# Altium project Standalone Battery Charger.PrjPcb (part 2 of 2)
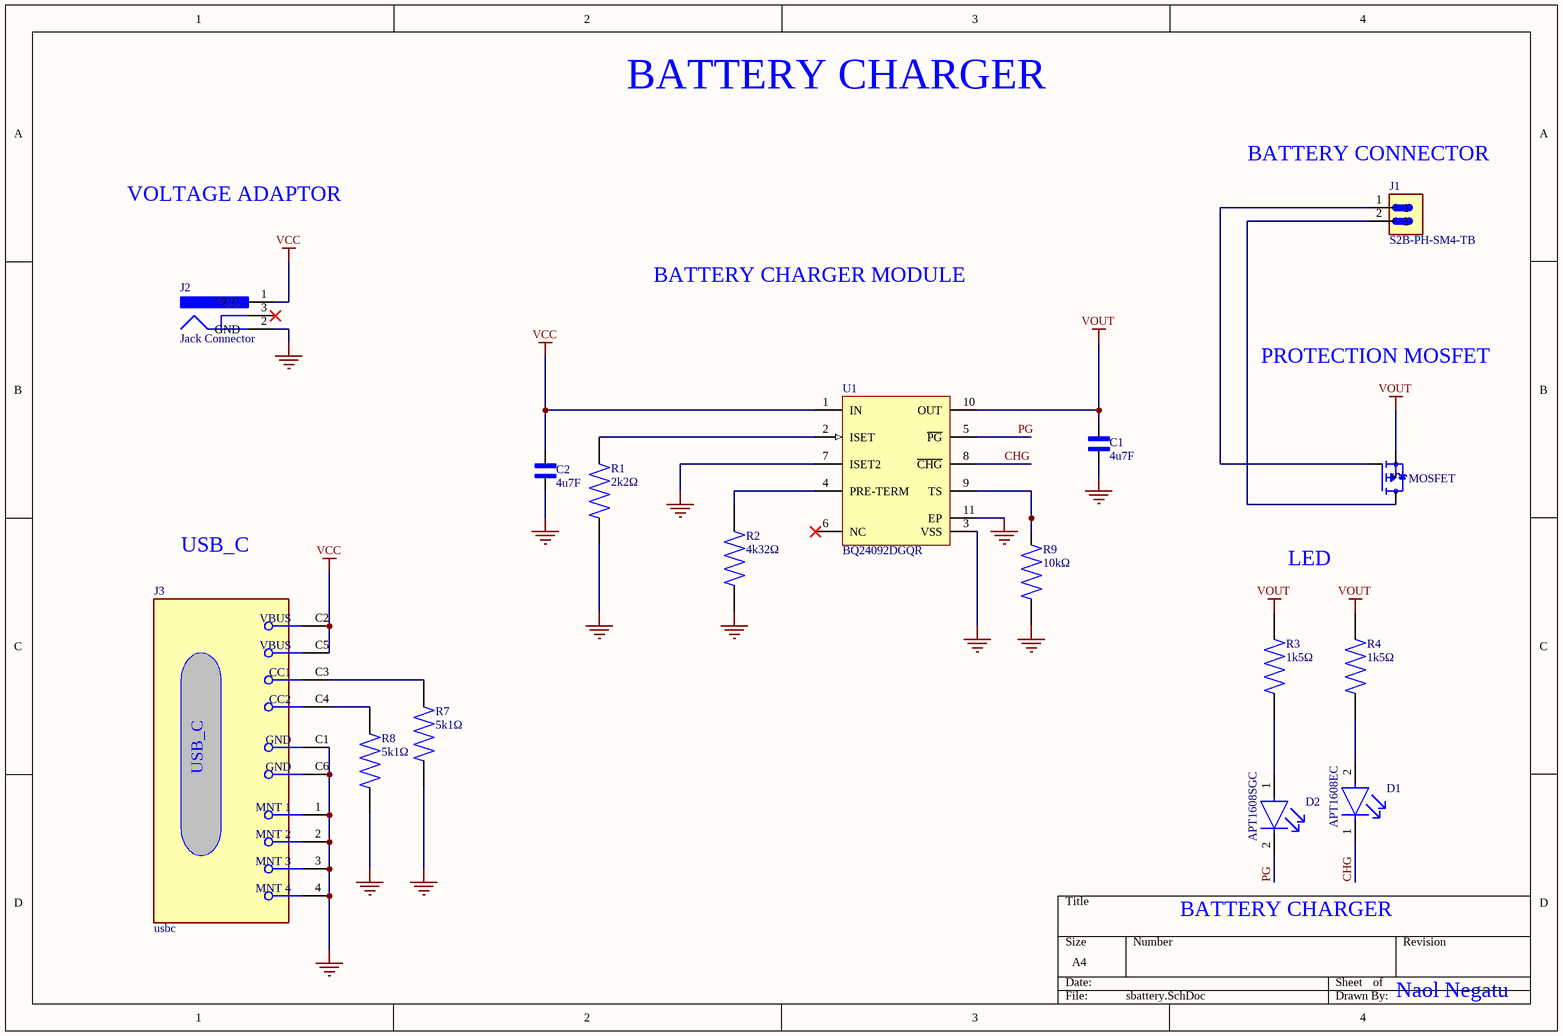
[diagram p1: sbattery.SchDoc]

## Sheet sbattery.SchDoc (continued)

### Library data of the parts (continued)
U1 = BQ24092DGQR: 1-cell, 1-A, Li-ion battery charger with operation over JEITA and 10kΩ NTC 10-HVSSOP -40 to 150; Manufacturer: Texas Instruments; Manufacturer Lifecycle Status: ACTIVE; Battery Pack Voltage: 4.2V; Fault Protection: Over Temperature, Over Voltage, Short Circuit; Interface: USB; Max Charge Current: 1A; Max Supply Voltage: 6.45V; Min Input Voltage: 4.5V; Min Supply Voltage: 3.5V; Number of Cells: 1; Supplier: DigiKey; Supplier Part Number: 296-41204-2-ND; Manufacturer Part Number: BQ24092DGQR; RoHS: Compliant; Category: Battery Management; Stock: 8548; Pricing: 2500=0.68891, 5000=0.67306, 7500=0.66512, 12500=0.65632 (USD); Case/Package: HTSSOP EP; Contact Plating: Gold; Height: 1.1mm; Lead Free: Lead Free; Length: 3mm; Lifecycle Status: Production; Max Operating Temperature: 125°C; Min Operating Temperature: -40°C; Pins: 10; Output Current: 1A; Output Voltage: 4.2V; Packaging: Tape & Reel (TR); Radiation Hardening: No; Schedule B: 8542390000, 8542390000|8542390000|8542390000|8542390000|8542390000; Thickness: 1.02mm; Width: 3mm; ComponentLink1URL: https://sigma.octopart.com:443/151908762/technical_drawing/Texas-Instruments-BQ24092DGQR.pdf?src-supplier=Texas+Instruments; ComponentLink1Description: https://sigma.octopart.com:443/151908762/technical_drawing/Texas-Instruments-BQ24092DGQR.pdf?src-supplier=Texas+Instruments; ComponentLink2URL: https://octopart.com:443/opatz8j6/c1?t=I4L_5yvCBpDFmJzBUD7xXRTyJHZFz8Vie7DDMexhgd_R5CVS8O1brsykVWSszK7PlQIjFRdFbRxs_cy10GZkWLPuEzsvgZTYF2NXEUHmN4sAQxE8bVBEcZC275qzirla-L-oJNJhEX5LmJmM2EXwk3EFsfYROaw8LmrFg9NhT1mx60rvpKNI9a36HI6ThgYwGQRStl18BqKQUrAbhSp5Wi_HxJff8WELpdCqiygBHP7SLygD4TmEifhtn01ouQFK53G1NLqB-fa8Ml_ZKfK0nFnib--2iALwfa4BBLIbsOyNQrybwu1ndBra9hRkefzWYbL7eDaQQPNTeA4Bly6oxRyA0mVZNRxcs2KHaGZXt2978JGPJtvfLop7MU-7fw_S1MKPRM0&src-supplier=Texas+Instruments; ComponentLink2Description: https://octopart.com:443/opatz8j6/c1?t=I4L_5yvCBpDFmJzBUD7xXRTyJHZFz8Vie7DDMexhgd_R5CVS8O1brsykVWSszK7PlQIjFRdFbRxs_cy10GZkWLPuEzsvgZTYF2NXEUHmN4sAQxE8bVBEcZC275qzirla-L-oJNJhEX5LmJmM2EXwk3EFsfYROaw8LmrFg9NhT1mx60rvpKNI9a36HI6ThgYwGQRStl18BqKQUrAbhSp5Wi_HxJff8WELpdCqiygBHP7SLygD4TmEifhtn01ouQFK53G1NLqB-fa8Ml_ZKfK0nFnib--2iALwfa4BBLIbsOyNQrybwu1ndBra9hRkefzWYbL7eDaQQPNTeA4Bly6oxRyA0mVZNRxcs2KHaGZXt2978JGPJtvfLop7MU-7fw_S1MKPRM0&src-supplier=Texas+Instruments; ComponentLink3URL: https://datasheet.octopart.com:443/BQ24092DGQR-Texas-Instruments-datasheet-41204735.pdf?src-supplier=Texas+Instruments; ComponentLink3Description: https://datasheet.octopart.com:443/BQ24092DGQR-Texas-Instruments-datasheet-41204735.pdf?src-supplier=Texas+Instruments; ComponentLink4URL: https://datasheet.octopart.com:443/BQ24092DGQR-Texas-Instruments-datasheet-34153142.pdf?src-supplier=Texas+Instruments; ComponentLink4Description: https://datasheet.octopart.com:443/BQ24092DGQR-Texas-Instruments-datasheet-34153142.pdf?src-supplier=Texas+Instruments; ComponentLink5URL: https://datasheet.octopart.com:443/BQ24092DGQR-Texas-Instruments-datasheet-17535491.pdf?src-supplier=Texas+Instruments; ComponentLink5Description: https://datasheet.octopart.com:443/BQ24092DGQR-Texas-Instruments-datasheet-17535491.pdf?src-supplier=Texas+Instruments; ComponentLink6URL: https://datasheet.octopart.com:443/BQ24092DGQR-Texas-Instruments-datasheet-13303862.pdf?src-supplier=Texas+Instruments; ComponentLink6Description: https://datasheet.octopart.com:443/BQ24092DGQR-Texas-Instruments-datasheet-13303862.pdf?src-supplier=Texas+Instruments; ComponentLink7URL: https://datasheet.octopart.com:443/BQ24092DGQR-Texas-Instruments-datasheet-13064149.pdf?src-supplier=Texas+Instruments; ComponentLink7Description: https://datasheet.octopart.com:443/BQ24092DGQR-Texas-Instruments-datasheet-13064149.pdf?src-supplier=Texas+Instruments; ComponentLink8URL: https://datasheet.octopart.com:443/BQ24092DGQR-Texas-Instruments-datasheet-13055535.pdf?src-supplier=Texas+Instruments; ComponentLink8Description: https://datasheet.octopart.com:443/BQ24092DGQR-Texas-Instruments-datasheet-13055535.pdf?src-supplier=Texas+Instruments; ComponentLink9URL: https://datasheet.octopart.com:443/BQ24092DGQR-Texas-Instruments-datasheet-11473890.pdf?src-supplier=Texas+Instruments; ComponentLink9Description: https://datasheet.octopart.com:443/BQ24092DGQR-Texas-Instruments-datasheet-11473890.pdf?src-supplier=Texas+Instruments; ComponentLink10URL: https://sigma.octopart.com:443/49250729/technical_drawing/Texas-Instruments-BQ24092DGQR.pdf?src-supplier=Texas+Instruments; ComponentLink10Description: https://sigma.octopart.com:443/49250729/technical_drawing/Texas-Instruments-BQ24092DGQR.pdf?src-supplier=Texas+Instruments; ComponentLink11URL: https://datasheet.octopart.com:443/BQ24092DGQR-Texas-Instruments-datasheet-10257820.pdf?src-supplier=Texas+Instruments; ComponentLink11Description: https://datasheet.octopart.com:443/BQ24092DGQR-Texas-Instruments-datasheet-10257820.pdf?src-supplier=Texas+Instruments; ComponentLink12URL: https://datasheet.octopart.com:443/BQ24092DGQR-Texas-Instruments-datasheet-164412855.pdf?src-supplier=SHENGYU+ELECTRONICS; ComponentLink12Description: https://datasheet.octopart.com:443/BQ24092DGQR-Texas-Instruments-datasheet-164412855.pdf?src-supplier=SHENGYU+ELECTRONICS; ComponentLink13URL: https://datasheet.octopart.com:443/BQ24092DGQR-Texas-Instruments-datasheet-137316104.pdf?src-supplier=Future+Electronics; ComponentLink13Description: https://datasheet.octopart.com:443/BQ24092DGQR-Texas-Instruments-datasheet-137316104.pdf?src-supplier=Future+Electronics; ComponentLink14URL: http://sigma.octopart.com:80/reach_statement/Texas-Instruments-company-64.pdf?src-supplier=Compliance+Statements; ComponentLink14Description: http://sigma.octopart.com:80/reach_statement/Texas-Instruments-company-64.pdf?src-supplier=Compliance+Statements; ComponentLink15URL: http://sigma.octopart.com:80/conflict_mineral_statement/Texas-Instruments-company-63.pdf?src-supplier=Compliance+Statements; ComponentLink15Description: http://sigma.octopart.com:80/conflict_mineral_statement/Texas-Instruments-company-63.pdf?src-supplier=Compliance+Statements; LCSC part#: C133237